# Altium project MotorBoardElectronics.PrjPcb
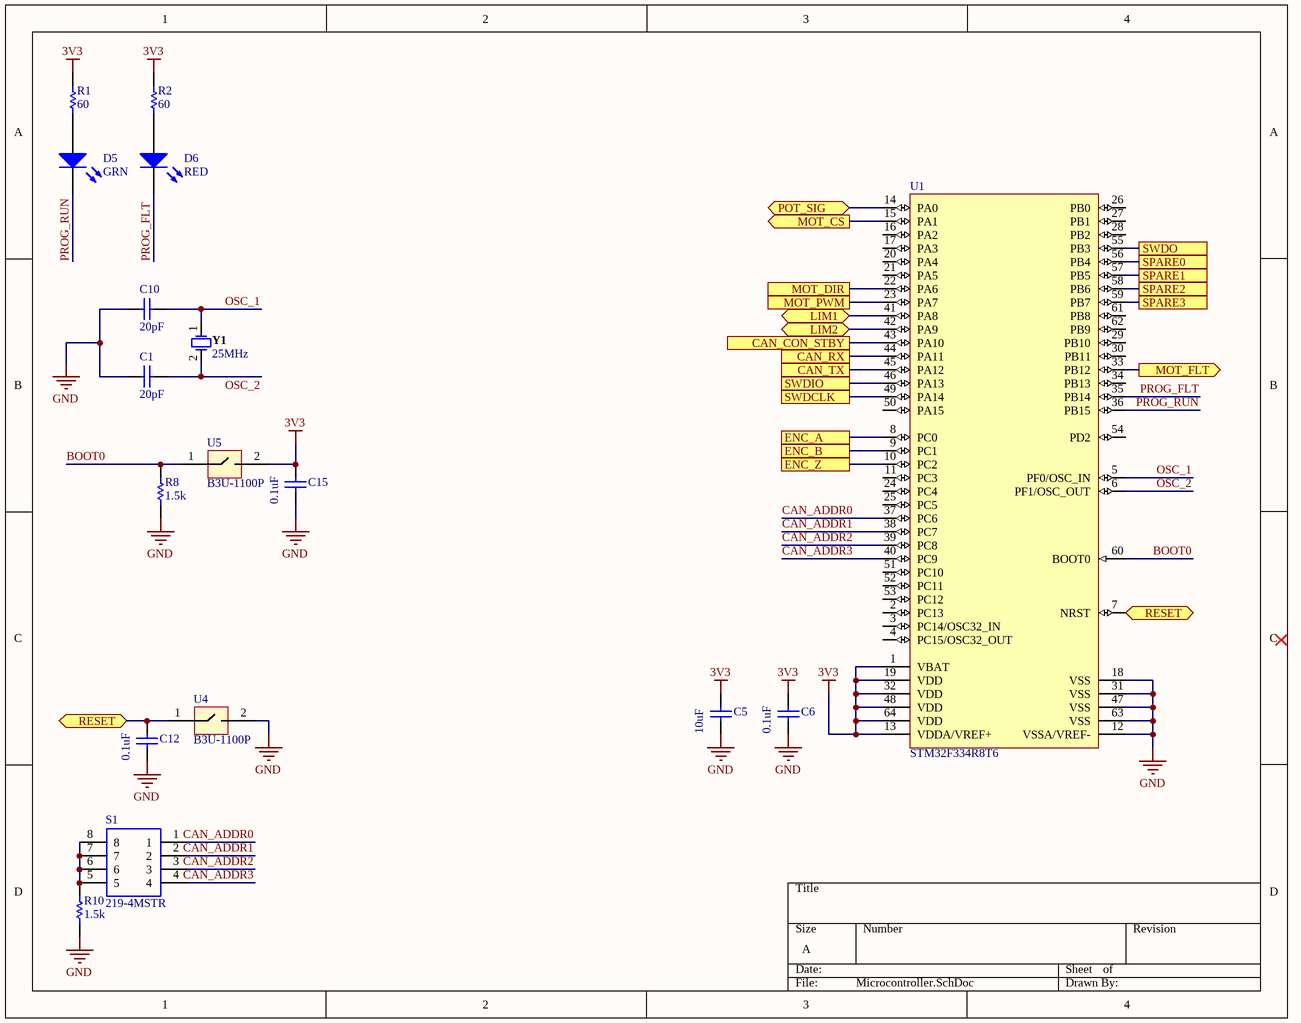
[diagram p0: Microcontroller.SchDoc]
3 sheets, 59 parts. Net scope: flat (ports and power ports of the same name join across sheets).
Board file: PCB.PcbDoc
Sheets:
  Microcontroller.SchDoc
  Peripherals.SchDoc
  Power.SchDoc

## Sheet Microcontroller.SchDoc
size A

### Parts
C1  value 20pF  [RESC2013X60X35LL10T20]  (hidden comment: Cap Semi)
C5  value 10uF  [RESC2013X60X35LL10T20]  (hidden comment: Cap Semi)
C6  value 0.1uF  [RESC2013X60X35LL10T20]  (hidden comment: Cap Semi)
C10  value 20pF  [RESC2013X60X35LL10T20]  (hidden comment: Cap Semi)
C12  value 0.1uF  [RESC2013X60X35LL10T20]  (hidden comment: Cap Semi)
C15  value 0.1uF  [RESC2013X60X35LL10T20]  (hidden comment: Cap Semi)
D5  GRN  [LED]
D6  RED  [LED]
R1  60  [RESC2013X60X35LL10T20]
R2  60  [RESC2013X60X35LL10T20]
R8  1.5k  [RESC2013X60X35LL10T20]
R10  1.5k  [RESC2013X60X35LL10T20]
S1  219-4MSTR  [SOP254P991X385-8N]
U1  STM32F334R8T6  [STM-LQFP64_L]
U4  B3U-1100P  [B3U-1100P - duplicate]
U5  B3U-1100P  [B3U-1100P - duplicate]
Y1  25MHz  [ADAI-THHF-49S3]

### Ports
CAN_CON_STBY, CAN_RX, CAN_TX, ENC_A, ENC_B, ENC_Z, LIM1 (bidir), LIM2 (bidir), MOT_CS (out), MOT_DIR, MOT_FLT (out), MOT_PWM, POT_SIG (bidir), RESET (bidir), SPARE0, SPARE1, SPARE2, SPARE3, SWDCLK, SWDIO, SWDO

### Nets
3V3: C5.2 C6.2 C15.2 R1.2 R2.2 U1.1(VBAT) U1.13(VDDA/VREF+) U1.19(VDD) U1.32(VDD) U1.48(VDD) U1.64(VDD) U5.2(NO_PUSH)
GND: C1.2 C5.1 C6.1 C10.2 C12.1 C15.1 R8.1 R10.1 U1.12(VSSA/VREF-) U1.18(VSS) U1.31(VSS) U1.47(VSS) U1.63(VSS) U4.2(NO_PUSH)
BOOT0: R8.2 U1.60(BOOT0) U5.1
CAN_ADDR0: S1.1 U1.37(PC6)
CAN_ADDR1: S1.2 U1.38(PC7)
CAN_ADDR2: S1.3 U1.39(PC8)
CAN_ADDR3: S1.4 U1.40(PC9)
OSC_1: C10.1 U1.5(PF0/OSC_IN) Y1.1
OSC_2: C1.1 U1.6(PF1/OSC_OUT) Y1.2
PROG_FLT: D6.2(K) U1.35(PB14)
PROG_RUN: D5.2(K) U1.36(PB15)
RAW_MOT_CS: U1.15(PA1) ; port MOT_CS
NetC4_1: U1.41(PA8) ; port LIM1
NetC12_2: C12.2 U1.7(NRST) U4.1 ; port RESET
NetC14_1: U1.14(PA0) ; port POT_SIG
NetC17_1: U1.42(PA9) ; port LIM2
NetD1_2: U1.33(PB12) ; port MOT_FLT
NetD5_1: D5.1(A) R1.1
NetD6_1: D6.1(A) R2.1
NetJ6_3: U1.8(PC0) ; port ENC_A
NetJ6_4: U1.9(PC1) ; port ENC_B
NetJ6_5: U1.10(PC2) ; port ENC_Z
NetJ9_3: U1.56(PB4) ; port SPARE0
NetJ9_4: U1.57(PB5) ; port SPARE1
NetJ9_5: U1.58(PB6) ; port SPARE2
NetJ9_6: U1.59(PB7) ; port SPARE3
NetPWM1_12: U1.23(PA7) ; port MOT_PWM
NetPWM1_13: U1.22(PA6) ; port MOT_DIR
NetR10_2: R10.2 S1.5 S1.6 S1.7 S1.8
NetU1_43: U1.43(PA10) ; port CAN_CON_STBY
NetU1_44: U1.44(PA11) ; port CAN_RX
NetU1_45: U1.45(PA12) ; port CAN_TX
NetU1_46: U1.46(PA13) ; port SWDIO
NetU1_49: U1.49(PA14) ; port SWDCLK
NetU1_55: U1.55(PB3) ; port SWDO

Not connected (* = marked no-connect by the designer): U1 2(PC13) 3(PC14/OSC32_IN) 4(PC15/OSC32_OUT) 11(PC3) 16(PA2) 17(PA3) 20(PA4) 21(PA5) 24(PC4) 25(PC5) 26(PB0) 27(PB1) 28(PB2) 29(PB10) 30(PB11) 34(PB13) 50(PA15) 51(PC10) 52(PC11) 53(PC12) 54(PD2) 61(PB8) 62(PB9)

### Library data of the parts
C1 C5 C6 C10 C12 C15 = Cap Semi: Capacitor (Semiconductor SIM Model); Published: 8-Jun-2000; LatestRevisionDate: 29-May-2009; LatestRevisionNote: IPC-7351 Footprint Added.; PackageReference: C1206; Publisher: Altium Limited; PackageDescription: Chip Capacitor
D5 D6 = LED0: Typical INFRARED GaAs LED; Published: 8-Jun-2000; LatestRevisionDate: 08-Jul-2005; LatestRevisionNote: Mech Layer 1 removed.; PackageReference: LED-0; Publisher: Altium Limited; PackageDescription: LED; 2 Leads
R1 R2 R8 R10 = RES-2
S1 = 219-4MSTR: DIP Switches / SIP Switches SPST 4 switch sections; Manufacturer_Name: CTS; Geometry.Height: 3.85mm; Manufacturer_Part_Number: 219-4MSTR; RS Part Number: 1774368; RS Price/Stock: http://uk.rs-online.com/web/p/products/1774368; Arrow Part Number: 219-4MSTR; Arrow Price/Stock: https://www.arrow.com/en/products/219-4mstr/cts; Datasheet Link: https://www.ctscorp.com/wp-content/uploads/219.pdf
U1 = CMP-0537-00077-1: ARM Cortex-M4 32-bit MCU, 64 KB Flash, 16 KB Internal RAM, 51 I/Os, 64-Pin LQFP, -40 to 85 degC, Tray; Supply Voltage(Vcc) min (V): 2; D/A Converter: 3; Internal RAM Size (kB): 16; FLASH Size (Prog) (kB): 64; Operating Frequency(F) (Processor speed) (MHz): 72; I/Os (High Current): 51; ComponentLink1Description: Manufacturer URL; ComponentLink2URL: http://www.st.com/st-web-ui/static/active/en/resource/technical/document/datasheet/DM00097745.pdf; Package Reference: LQFP64; ComponentLink1URL: http://www.st.com/; ComponentLink2Description: Datasheet; DatasheetVersion: Rev. 4; Mounting Technology: Surface Mount; Package Description: 64-Pin Low-profile Quad Flat Package, Body 10 x 10 mm, Pitch 0.5 mm; Packing: Tray; Core: ARM Cortex-M4
Y1 = CMP-1740-00004-1: Elements: 1; Max Dual Supply Voltage: 15 V; Propagation Delay: 115 ns; Nominal Dual Supply Voltage: 12 V; Case\Package: PDIP; Min Supply Voltage: 3.5 V; Min Dual Supply Voltage: 1.75 V; Nominal Voltage Gain: 106.02 dB; Nominal Supply Current: 7.5 mA; Max Supply Voltage: 30 V; PackageDescription: 2-Pin Through Hole Device, Body 11.05 x 4.65 mm, Pitch 4.88 mm; Length: 9.81 mm; ComponentLink2URL: https://cdn-shop.adafruit.com/product-files/2214/2214datasheet.pdf; REACH SVHC: No SVHC; PackageReference: THHF-49S3; DatasheetVersion: Nov-14; ComponentLink1URL: https://www.adafruit.com/; Height: 4.57 mm; Width: 6.35 mm; Channels: 1; ComponentLink2Description: Datasheet; Max Operating Temperature: 70 degC; Packaging: Rail/Tube; Nominal Supply Voltage: 12 V; Weight: 0.015535 oz; Package Quantity: 50; RoHSCompliant: true; Radiation Hardening: No; Pins: 8; ComponentLink1Description: Manufacturer URL; Min Operating Temperature: 0 degC; Mount: Through Hole

## Sheet Peripherals.SchDoc
size A
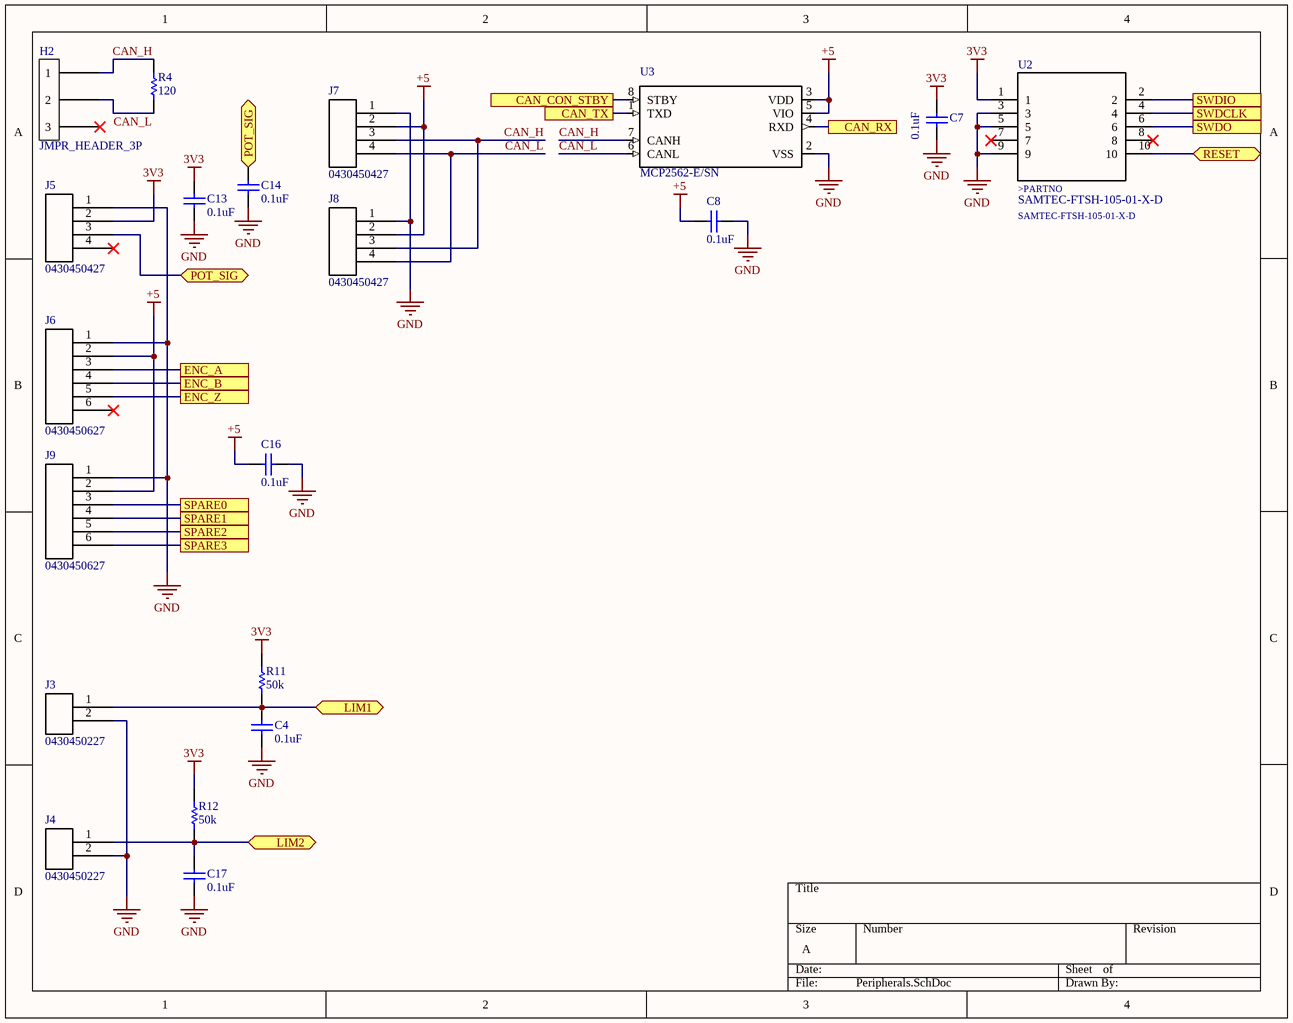
[diagram p1: Peripherals.SchDoc]

### Parts
C4  value 0.1uF  [RESC2013X60X35LL10T20]  (hidden comment: Cap Semi)
C7  value 0.1uF  [RESC2013X60X35LL10T20]  (hidden comment: Cap Semi)
C8  value 0.1uF  [RESC2013X60X35LL10T20]  (hidden comment: Cap Semi)
C13  value 0.1uF  [RESC2013X60X35LL10T20]  (hidden comment: Cap Semi)
C14  value 0.1uF  [RESC2013X60X35LL10T20]  (hidden comment: Cap Semi)
C16  value 0.1uF  [RESC2013X60X35LL10T20]  (hidden comment: Cap Semi)
C17  value 0.1uF  [RESC2013X60X35LL10T20]  (hidden comment: Cap Semi)
H2  JMPR_HEADER_3P  [STD3P]
J3  0430450227  [0430450227]
J4  0430450227  [0430450227]
J5  0430450427  [0430450427]
J6  0430450627  [0430450627]
J7  0430450427  [0430450427]
J8  0430450427  [0430450427]
J9  0430450627  [0430450627]
R4  120  [RESC2013X60X35LL10T20]
R11  50k  [RESC2013X60X35LL10T20]
R12  50k  [RESC2013X60X35LL10T20]
U2  SAMTEC-FTSH-105-01-X-D  [SAMTEC-FTSH-105-01-X-D]
U3  MCP2562-E/SN  [SOIC127P600X175-8N]

### Ports
CAN_CON_STBY, CAN_RX, CAN_TX, ENC_A, ENC_B, ENC_Z, LIM1 (bidir), LIM2 (bidir), POT_SIG (bidir), RESET (bidir), SPARE0, SPARE1, SPARE2, SPARE3, SWDCLK, SWDIO, SWDO

### Nets
3V3: C7.2 C13.1 J5.2 R11.1 R12.1 U2.1
+5: C8.2 C16.2 J6.2 J7.2 J8.2 J9.2 U3.3(VDD) U3.5(VIO)  [project net SEL_5V]
GND: C4.2 C7.1 C8.1 C13.2 C14.2 C16.1 C17.2 J3.2 J4.2 J5.1 J6.1 J7.1 J8.1 J9.1 U2.3 U2.5 U2.9 U3.2(VSS)
CAN_H: H2.1 J7.3 J8.3 R4.1 U3.7(CANH)
CAN_L: H2.2 J7.4 J8.4 R4.2 U3.6(CANL)
NetC4_1: C4.1 J3.1 R11.2 ; port LIM1
NetC12_2: U2.10 ; port RESET
NetC14_1: C14.1 J5.3 ; port POT_SIG
NetC17_1: C17.1 J4.1 R12.2 ; port LIM2
NetJ6_3: J6.3 ; port ENC_A
NetJ6_4: J6.4 ; port ENC_B
NetJ6_5: J6.5 ; port ENC_Z
NetJ9_3: J9.3 ; port SPARE0
NetJ9_4: J9.4 ; port SPARE1
NetJ9_5: J9.5 ; port SPARE2
NetJ9_6: J9.6 ; port SPARE3
NetU1_43: U3.8(STBY) ; port CAN_CON_STBY
NetU1_44: U3.4(RXD) ; port CAN_RX
NetU1_45: U3.1(TXD) ; port CAN_TX
NetU1_46: U2.2 ; port SWDIO
NetU1_49: U2.4 ; port SWDCLK
NetU1_55: U2.6 ; port SWDO

Not connected (* = marked no-connect by the designer): H2 3*; J5 4*; J6 6*; U2 7* 8*

### Notes on the sheet
- (in symbol SAMTEC-FTSH-105-01-X-D) >PARTNO

### Library data of the parts
C4 C7 C8 C13 C14 C16 C17 = Cap Semi: Capacitor (Semiconductor SIM Model); Published: 8-Jun-2000; LatestRevisionDate: 29-May-2009; LatestRevisionNote: IPC-7351 Footprint Added.; PackageReference: C1206; Publisher: Altium Limited; PackageDescription: Chip Capacitor
J3 J4 = 0430450227-Single row schematic: Micro-fit 3.0 connector. P/N 0430450227
J5 J7 J8 = 0430450427-Single row schematic: Molex micro-fit 3.0 dual row header. P/N 0430450427
J6 J9 = 0430450627-Single row schematic: Molex micro-fit 3.0 dual row connector. P/N 0430450627
R4 R11 R12 = RES-2
U2 = SAMTEC-FTSH-105-01-X-D: Conn Unshrouded Header HDR 10 POS 1.27mm Solder ST Thru-Hole Automotive Tube; MP: FTSH-105-01-F-D-K; MF: Samtec Inc.; SnapEDA_Link: https://www.snapeda.com/parts/FTSH-105-01-F-D-K/Samtec%20Inc./view-part/?ref=snap; Digi-Key_Part_Number: SAM8909-ND; Digi-Key_Purchase_URL: https://www.digikey.com/product-detail/en/samtec-inc/FTSH-105-01-F-D-K/SAM8909-ND/1850757?utm_source=snapeda&utm_medium=aggregator&utm_campaign=symbol; Package: None; Value: *
U3 = MCP2562-E/SN: Microchip MCP2562-E/SN, CAN Transceiver 1MBps 1-channel IEC 61000-4-2, 8-Pin SOIC; Price: None; MF: Microchip; SnapEDA_Link: https://www.snapeda.com/parts/MCP2562-E/SN/Microchip/view-part/?ref=snap; MP: MCP2562-E/SN; Availability: Unavailable; Package: SO-8 Microchip; Value: *

## Sheet Power.SchDoc
size A
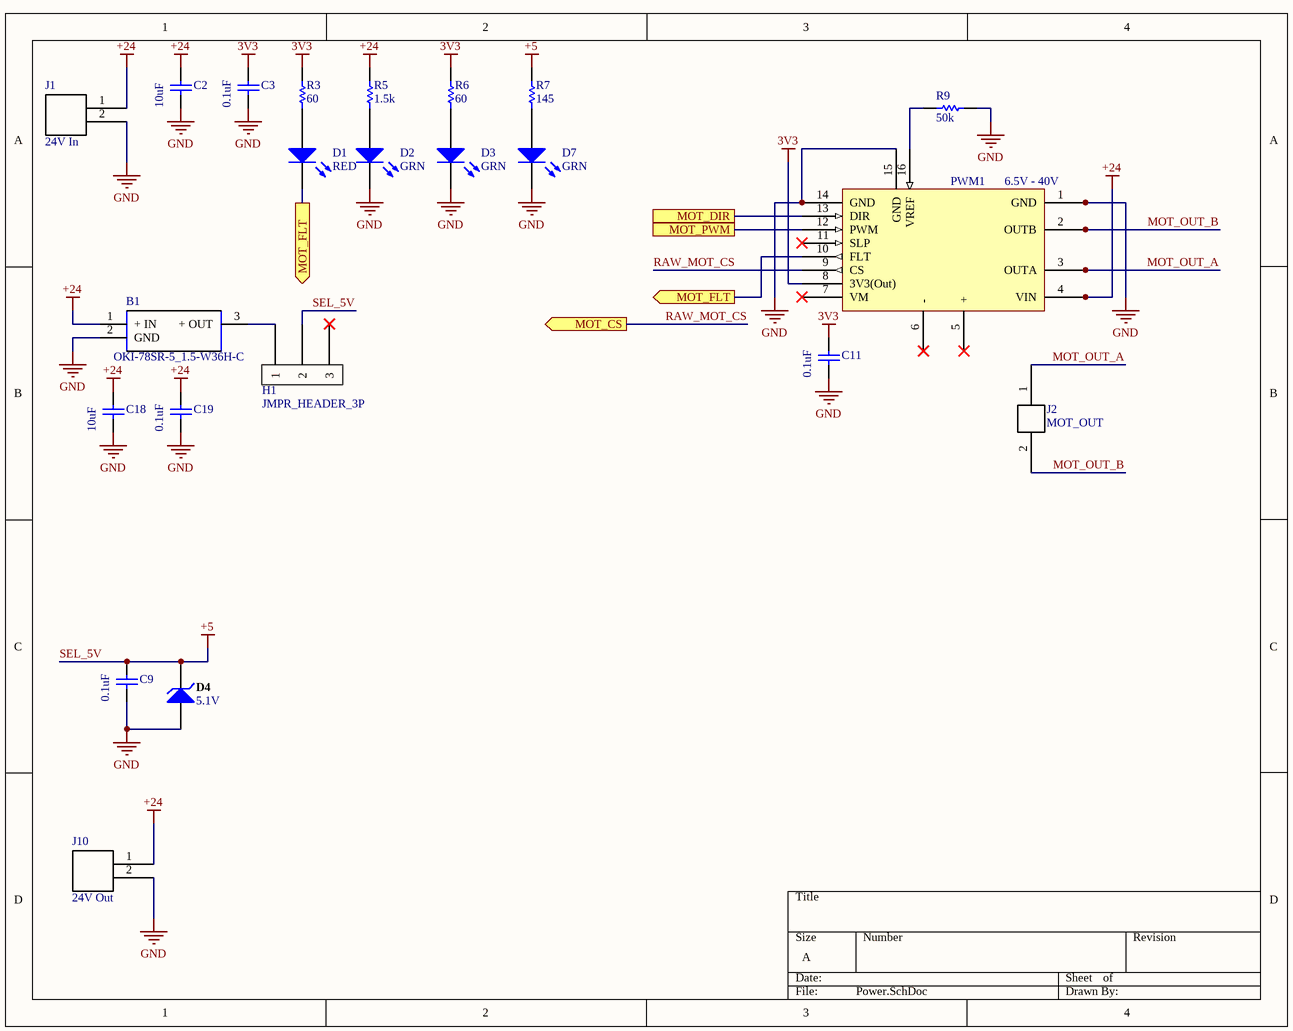
[diagram p2: Power.SchDoc]

### Parts
B1  OKI-78SR-5_1.5-W36H-C  [OKI-78SR-HORIZONTAL]
C2  value 10uF  [RESC2013X60X35LL10T20]  (hidden comment: Cap Semi)
C3  value 0.1uF  [RESC2013X60X35LL10T20]  (hidden comment: Cap Semi)
C9  value 0.1uF  [RESC2013X60X35LL10T20]  (hidden comment: Cap Semi)
C11  value 0.1uF  [RESC2013X60X35LL10T20]  (hidden comment: Cap Semi)
C18  value 10uF  [RESC2013X60X35LL10T20]  (hidden comment: Cap Semi)
C19  value 0.1uF  [RESC2013X60X35LL10T20]  (hidden comment: Cap Semi)
D1  RED  [LED]
D2  GRN  [LED]
D3  GRN  [LED]
D4  5.1V  [VISH-SOD-123-2_V]
D7  GRN  [LED]
H1  JMPR_HEADER_3P  [STD3P]
J1  24V In  [1510482204]
J2  MOT_OUT  [0430450227]
J10  24V Out  [1510482204]
PWM1  6.5V - 40V  [Pololu_G2_Driver_24v21]
R3  60  [RESC2013X60X35LL10T20]
R5  1.5k  [RESC2013X60X35LL10T20]
R6  60  [RESC2013X60X35LL10T20]
R7  145  [RESC2013X60X35LL10T20]
R9  50k  [RESC2013X60X35LL10T20]

### Ports
MOT_CS (out), MOT_DIR, MOT_FLT (out), MOT_PWM

### Nets
3V3: C3.2 C11.2 PWM1.8(3V3(Out)) R3.2 R6.2
+24: B1.1(+_IN) C2.2 C18.2 C19.2 J1.1 J10.1 PWM1.4(VIN) PWM1.4a(VIN) PWM1.4b(VIN) R5.2
GND: B1.2(GND) C2.1 C3.1 C9.1 C11.1 C18.1 C19.1 D2.2(K) D3.2(K) D4.1(A) D7.2(K) J1.2 J10.2 PWM1.1(GND) PWM1.1a(GND) PWM1.1b(GND) PWM1.14(GND) PWM1.15(GND) R9.1
SEL_5V: C9.2 D4.2(K) H1.2 R7.2  [also labelled +5]
MOT_OUT_A: J2.1 PWM1.3(OUTA) PWM1.3a(OUTA) PWM1.3b(OUTA)
MOT_OUT_B: J2.2 PWM1.2(OUTB) PWM1.2a(OUTB) PWM1.2b(OUTB)
RAW_MOT_CS: PWM1.9(CS) ; port MOT_CS
NetB1_3: B1.3(+_OUT) H1.1
NetD1_1: D1.1(A) R3.1
NetD1_2: D1.2(K) PWM1.10(FLT) ; port MOT_FLT
NetD2_1: D2.1(A) R5.1
NetD3_1: D3.1(A) R6.1
NetD7_1: D7.1(A) R7.1
NetPWM1_12: PWM1.12(PWM) ; port MOT_PWM
NetPWM1_13: PWM1.13(DIR) ; port MOT_DIR
NetPWM1_16: PWM1.16(VREF) R9.2

Not connected (* = marked no-connect by the designer): H1 3*; PWM1 5(+)* 6(-)* 7(VM)* 11(SLP)*

### Library data of the parts
B1 = OKI-78SR-5_1.5-W36H-C: Switching Regulator 7-36Vin 5Vo 1.5A Non-Isolated DC-DC Converter, 5V dc Output, 1.5A; Manufacturer_Name: Murata Electronics; Manufacturer_Part_Number: OKI-78SR-5/1.5-W36H-C; Mouser Part Number: 580-OKI78SR51.5W36HC; Datasheet Link: https://componentsearchengine.com/Datasheets/1/OKI-78SR-5_1.5-W36H-C.pdf
C2 C3 C9 C11 C18 C19 = Cap Semi: Capacitor (Semiconductor SIM Model); Published: 8-Jun-2000; LatestRevisionDate: 29-May-2009; LatestRevisionNote: IPC-7351 Footprint Added.; PackageReference: C1206; Publisher: Altium Limited; PackageDescription: Chip Capacitor
D1-D3 D7 = LED0: Typical INFRARED GaAs LED; Published: 8-Jun-2000; LatestRevisionDate: 08-Jul-2005; LatestRevisionNote: Mech Layer 1 removed.; PackageReference: LED-0; Publisher: Altium Limited; PackageDescription: LED; 2 Leads
D4 = CMP-0931-00020-1: Manufacturer: Vishay Semiconductor; PartNumber: MMSZ5232B-E3-08; Power Dissipation (mW): 500; Test Current (IZT1) (mA): 20; Zener Voltage (NOM.) (V): 5.6; Zener Impedance (IZT1) (Max.) (Ohm): 11; Tolerance: +/- 5%; Packing: Tape and Reel; Int. Construction: Single; ComponentLink2URL: http://www.vishay.com/docs/85774/mmsz5225.pdf; PackageVersion: Rev. 1.9; Operating Temperature: -55 to 150 degC; ComponentLink1Description: Manufacturer URL; ComponentLink3Description: Package Specification; DatasheetVersion: Rev. 1.9; PackageReference: SOD-123-2; ComponentLink3URL: http://www.vishay.com/docs/85774/mmsz5225.pdf; PackageDescription: 2-Pin SMD, Body 2.7 x 1.55 mm, Height 1.35 mm; ComponentLink1URL: http://www.vishay.com/; RoHS: TRUE; ComponentLink2Description: Datasheet; Mounting Technology: Surface Mount
J1 J10 = Molex 6.5MM 2 pin connector: Molex 6.5MM 2 pin connector, used for power connections. P/N 1510482204 and similar models.
J2 = Molex micro-fit 2-pin: Molex micro-fit 3.0. Molex P/N 0430450227
PWM1 = Pololu G2 High-Power Motor Driver 24v21: This discrete MOSFET H-bridge motor driver enables bidirectional control of one high-power DC brushed motor. The small 1.3″ × 0.8″ board supports a wide 6.5 V to 40 V voltage range and is efficient enough to deliver a continuous 21 A without a heat sink. Additional features of this second-generation (G2) driver include reverse-voltage protection along with basic current sensing and current limiting functionality.; ComponentLink1Description: Product Info; ComponentLink1URL: https://www.pololu.com/product/2995/specs
R3 R5-R7 R9 = RES-2

## Nets that join several sheets
3V3: Microcontroller (12 pins), Peripherals (6 pins), Power (5 pins)
GND: Microcontroller (14 pins), Peripherals (18 pins), Power (19 pins)
SEL_5V: Peripherals (8 pins), Power (C9.2 D4.2 H1.2 R7.2)
NetC4_1: Microcontroller (U1.41), Peripherals (C4.1 J3.1 R11.2)
NetC12_2: Microcontroller (C12.2 U1.7 U4.1), Peripherals (U2.10)
NetC14_1: Microcontroller (U1.14), Peripherals (C14.1 J5.3)
NetC17_1: Microcontroller (U1.42), Peripherals (C17.1 J4.1 R12.2)
NetD1_2: Microcontroller (U1.33), Power (D1.2 PWM1.10)
NetJ6_3: Microcontroller (U1.8), Peripherals (J6.3)
NetJ6_4: Microcontroller (U1.9), Peripherals (J6.4)
NetJ6_5: Microcontroller (U1.10), Peripherals (J6.5)
NetJ9_3: Microcontroller (U1.56), Peripherals (J9.3)
NetJ9_4: Microcontroller (U1.57), Peripherals (J9.4)
NetJ9_5: Microcontroller (U1.58), Peripherals (J9.5)
NetJ9_6: Microcontroller (U1.59), Peripherals (J9.6)
NetPWM1_12: Microcontroller (U1.23), Power (PWM1.12)
NetPWM1_13: Microcontroller (U1.22), Power (PWM1.13)
NetU1_43: Microcontroller (U1.43), Peripherals (U3.8)
NetU1_44: Microcontroller (U1.44), Peripherals (U3.4)
NetU1_45: Microcontroller (U1.45), Peripherals (U3.1)
NetU1_46: Microcontroller (U1.46), Peripherals (U2.2)
NetU1_49: Microcontroller (U1.49), Peripherals (U2.4)
NetU1_55: Microcontroller (U1.55), Peripherals (U2.6)
RAW_MOT_CS: Microcontroller (U1.15), Power (PWM1.9)